# Altium schematic sheet Sheet2.SchDoc
size A4
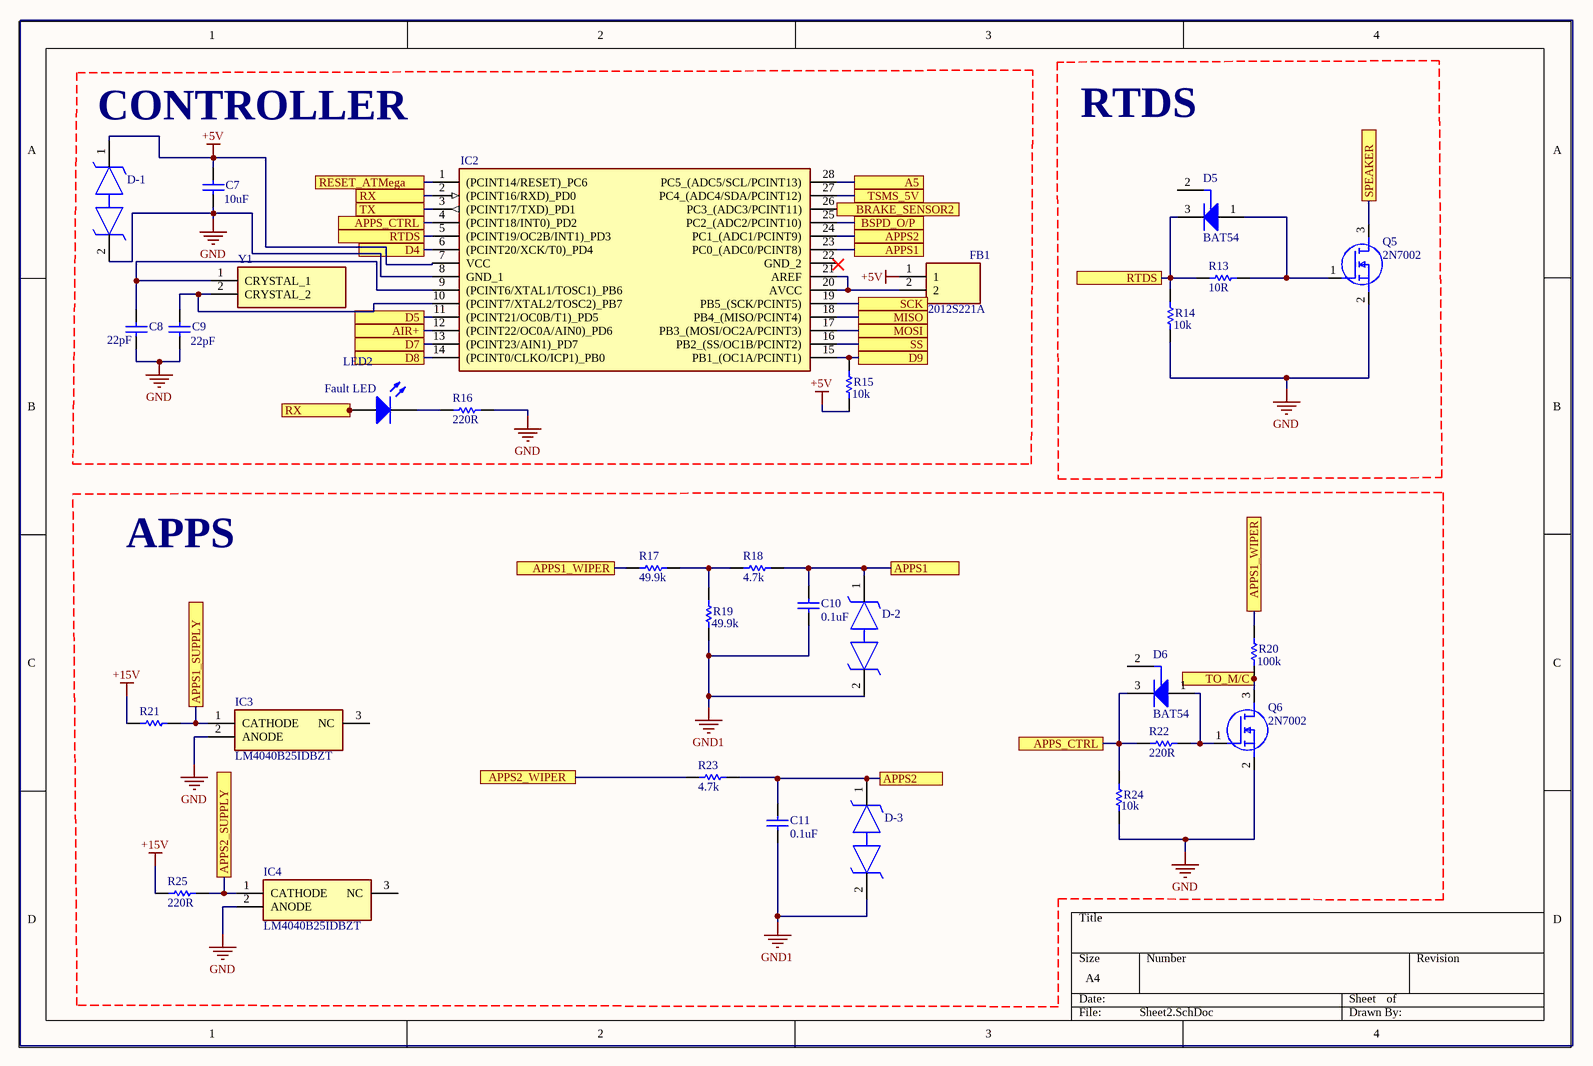
[diagram p0: Sheet2.SchDoc]

## Parts
C7  10uF  [KEMT-1206-2_N]
C8  22pF  [KEMT-1206-2_N]
C9  22pF  [KEMT-1206-2_N]
C10  0.1uF  [KEMT-1206-2_N]
C11  0.1uF  [KEMT-1206-2_N]
D5  BAT54  [INF-SOT23_N]
D6  BAT54  [INF-SOT23_N]
D-1  TPD1E6B06DPLR  [R1206]  (value not drawn)
D-2  TPD1E6B06DPLR  [R1206]  (value not drawn)
D-3  TPD1E6B06DPLR  [R1206]  (value not drawn)
Fault_LED  LED2  [3.2X1.6X1.1]
FB1  MPZ2012S221A  [BEADC2012X105N]
IC2  ATMEGA328-PU  [DIP1016W53P254L3468H457Q28N]  (value not drawn)
IC3  LM4040B25IDBZT  [SOT95P237X112-3N]
IC4  LM4040B25IDBZT  [SOT95P237X112-3N]
Q5  2N7002  [SOT96P240X120-3N]
Q6  2N7002  [SOT96P240X120-3N]
R13  10R  [RESC3216X60X45NL10T20 - duplicate]
R14  10k  [RESC3216X60X45NL10T20 - duplicate]
R15  10k  [RESC3216X60X45NL10T20 - duplicate]
R16  220R  [RESC3216X60X45NL10T20 - duplicate]
R17  49.9k  [RESC3216X60X45NL10T20 - duplicate]
R18  4.7k  [RESC3216X60X45NL10T20 - duplicate]
R19  49.9k  [RESC3216X60X45NL10T20 - duplicate]
R20  100k  [RESC3216X60X45NL10T20 - duplicate]
R21  CRCW120647K0FKEA  [RESC3216X60X45NL10T20 - duplicate]  (value not drawn)
R22  220R  [RESC3216X60X45NL10T20 - duplicate]
R23  4.7k  [RESC3216X60X45NL10T20 - duplicate]
R24  10k  [RESC3216X60X45NL10T20 - duplicate]
R25  220R  [RESC3216X60X45NL10T20 - duplicate]
Y1  ECS-160-18-4X-CKM  [ECS160184XCKM]  (value not drawn)

## Blocks framed on the sheet
CONTROLLER: C7-C9 D-1 Fault_LED FB1 IC2 R15 R16 Y1
APPS: C10 C11 D6 D-2 D-3 IC3 IC4 Q6 R17-R25

## Ports
A5, AIR+, APPS1, APPS1_SUPPLY, APPS1_WIPER, APPS2, APPS2_SUPPLY, APPS2_WIPER, APPS_CTRL, BRAKE_SENSOR2, BSPD_O/P, D4, D5, D7, D8, D9, MISO, MOSI, RESET_ATMega, RTDS, RX, SCK, SPEAKER, SS, TO_M/C, TSMS_5V, TX

## Nets
+5V: C7.2 D-1.1 FB1.1 IC2.7(VCC) R15.1
+15V: R21.2 R25.2
GND: C7.1 C8.1 C9.1 D-1.2 IC2.8(GND_1) IC3.2(ANODE) IC4.2(ANODE) Q5.2(S) Q6.2(S) R14.1 R16.1 R24.1
GND1: C10.1 C11.1 D-2.2 D-3.2 R19.1
A5: IC2.28(PC5_(ADC5/SCL/PCINT13)) ; port A5
AIR+: IC2.12((PCINT22/OC0A/AIN0)_PD6) ; port AIR+
APPS1: C10.2 D-2.1 IC2.23(PC0_(ADC0/PCINT8)) R18.1 ; port APPS1
APPS1_SUPPLY: IC3.1(CATHODE) R21.1 ; port APPS1_SUPPLY
APPS1_WIPER: R17.2 R20.2 ; port APPS1_WIPER
APPS2: C11.2 D-3.1 IC2.24(PC1_(ADC1/PCINT9)) R23.1 ; port APPS2
APPS2_SUPPLY: IC4.1(CATHODE) R25.1 ; port APPS2_SUPPLY
APPS2_WIPER: R23.2 ; port APPS2_WIPER
APPS_CTRL: D6.3(K) IC2.4((PCINT18/INT0)_PD2) R22.2 R24.2 ; port APPS_CTRL
BRAKE_SENSOR2: IC2.26(PC3_(ADC3/PCINT11)) ; port BRAKE_SENSOR2
BSPD_O/P: IC2.25(PC2_(ADC2/PCINT10)) ; port BSPD_O/P
D4: IC2.6((PCINT20/XCK/T0)_PD4) ; port D4
D5: IC2.11((PCINT21/OC0B/T1)_PD5) ; port D5
D7: IC2.13((PCINT23/AIN1)_PD7) ; port D7
D8: IC2.14((PCINT0/CLKO/ICP1)_PB0) ; port D8
D9: IC2.15(PB1_(OC1A/PCINT1)) R15.2 ; port D9
MISO: IC2.18(PB4_(MISO/PCINT4)) ; port MISO
MOSI: IC2.17(PB3_(MOSI/OC2A/PCINT3)) ; port MOSI
RESET_ATMega: IC2.1((PCINT14/RESET)_PC6) ; port RESET_ATMega
RTDS: D5.3(K) IC2.5((PCINT19/OC2B/INT1)_PD3) R13.2 R14.2 ; port RTDS
RX: Fault_LED.1(A) IC2.2((PCINT16/RXD)_PD0) ; port RX
SCK: IC2.19(PB5_(SCK/PCINT5)) ; port SCK
SPEAKER: Q5.3(D) ; port SPEAKER
SS: IC2.16(PB2_(SS/OC1B/PCINT2)) ; port SS
TO_M/C: Q6.3(D) R20.1 ; port TO_M/C
TSMS_5V: IC2.27(PC4_(ADC4/SDA/PCINT12)) ; port TSMS_5V
TX: IC2.3((PCINT17/TXD)_PD1) ; port TX
NetC8_2: C8.2 IC2.9((PCINT6/XTAL1/TOSC1)_PB6) Y1.1(CRYSTAL_1)
NetC9_2: C9.2 IC2.10((PCINT7/XTAL2/TOSC2)_PB7) Y1.2(CRYSTAL_2)
NetD5_1: D5.1(A) Q5.1(G) R13.1
NetD6_1: D6.1(A) Q6.1(G) R22.1
NetFault_LED_2: Fault_LED.2(K) R16.2
NetFB1_2: FB1.2 IC2.20(AVCC) IC2.21(AREF)
NetR17_1: R17.1 R18.2 R19.2

Not connected (* = marked no-connect by the designer): D5 2(NC); D6 2(NC); IC2 22(GND_2); IC3 3(NC); IC4 3(NC)

## Notes on the sheet
- RTDS

## Library data of the parts
C7-C11 = CMP-1037-04202-2: CAP, Ceramic, 0.1 uF, +/- 10%, 50 V, -55 to 125 degC, 1206 (3216 Metric), RoHS, Tape and Reel; Manufacturer: Kemet; Voltage Rating: 50V; Capacitance: 0.1µF; Product Range: KEMET-CSeries; SVHC: ToBeAdvised; Dielectric Characteristic: X7R; Capacitor Case Style: 1206[3216Metric]; Package Reference: 1206-2; Package Description: 2-Leads SMD, Body 3.2 x 1.6 mm; Packaging: Tape&Reel; Operating Temperature Max: 125degC; Capacitance Tolerance: ±10%; Datasheet URL: https://datasheet.ciiva.com/6125/1725438-6125494.pdf; Manufacturer URL: http://www.kemet.com/; Operating Temperature Min: -55degC; Datasheet Version: Jul-13
D5 D6 = CMP-1182-00010-1: Silicon Schottky Diode, SOT23, Reel, Green; Manufacturer: Infineon; VF (max): 800Â mV; Configuration: Single; IF (max): 200Â mA; CT (max): 10Â pF; Green: TRUE; VR (max): 30Â V; PartNumber: BAT54; ComponentLink2URL: http://www.infineon.com/dgdl/bat54series.pdf?folderId=db3a30431400ef68011425f1ca2505e3&fileId=db3a304314dca3890115190b74210ea6; ComponentLink3Description: Package Specification; PackageVersion: Apr-08; PackageDescription: 3-Pin Small Outline Transistor Package, 1.3 x 2.9 mm Body, 0.95 mm Pitch; ComponentLink1Description: Manufacturer URL; ComponentLink1URL: http://www.infineon.com/; Mounting Technology: Surface Mount; Packing: Reel; ComponentLink2Description: Datasheet; PackageReference: SOT23; ComponentLink3URL: http://www.infineon.com/dgdl/SOT23-Package_Overview.pdf?folderId=db3a30431936bc4b0119532290053c66&fileId=db3a30431936bc4b0119533468123c85
Fault_LED = LED2: Typical RED, GREEN, YELLOW, AMBER GaAs LED; Published: 8-Jun-2000; LatestRevisionDate: 17-Jul-2002; LatestRevisionNote: Re-released for DXP Platform.; PackageVersion: Feb-2002; PackageReference: 3.2X1.6X1.1; Publisher: Altium Limited; PackageDescription: SM LED; 2 Flat Leads
FB1 = MPZ2012S221A: Ferrite Bead; Manufacturer_Name: TDK; Datasheet Link: https://product.tdk.com/info/en/catalog/datasheets/beads_commercial_power_mpz2012_en.pdf; Height: 1.05mm; Manufacturer_Part_Number: MPZ2012S221A; Mouser Part Number: 810-MPZ2012S221A; Mouser Price/Stock: https://www.mouser.co.uk/ProductDetail/TDK/MPZ2012S221A?qs=g8DL0B6GkTmmIcDMLnw6hw%3D%3D
IC2 = ATMEGA328-PU: Integrated Circuit; Manufacturer_Name: Microchip; Datasheet Link: https://componentsearchengine.com/Datasheets/1/ATMEGA328-PU.pdf; Height: 4.572mm; Manufacturer_Part_Number: ATMEGA328-PU; Mouser Part Number: 556-ATMEGA328-PU; Mouser Price/Stock: https://www.mouser.co.uk/ProductDetail/Microchip-Technology-Atmel/ATMEGA328-PU?qs=lwdSMh1%2FoYJT8tfItQpQtA%3D%3D; Arrow Part Number: ATMEGA328-PU; Arrow Price/Stock: https://www.arrow.com/en/products/atmega328-pu/microchip-technology
IC3 IC4 = LM4040B25IDBZT: Integrated Circuit; Manufacturer_Name: Texas Instruments; Datasheet Link: https://www.ti.com/lit/gpn/LM4040; Height: 1.12mm; Manufacturer_Part_Number: LM4040B25IDBZT; Mouser Part Number: 595-LM4040B25IDBZT; Mouser Price/Stock: https://www.mouser.com/Search/Refine.aspx?Keyword=595-LM4040B25IDBZT; Arrow Part Number: LM4040B25IDBZT; Arrow Price/Stock: https://www.arrow.com/en/products/lm4040b25idbzt/texas-instruments
Q5 Q6 = 2N7002: MOSFET (N-Channel); Manufacturer_Name: Vishay; Datasheet Link: https://www.diodes.com/assets/Datasheets/ds11303.pdf; Height: 1.2mm; Manufacturer_Part_Number: 2N7002; Mouser Part Number: 781-2N7002; Mouser Price/Stock: https://www.mouser.co.uk/ProductDetail/Vishay-Siliconix/2N7002?qs=xBpwZ0JX2zKeuvZKtdYLZQ%3D%3D
R13-R20 R22-R25 = CMP-2003-02213-1: Part Number: CRCW120647K0FKEA; Manufacturer: Vishay Dale
R21 = CMP-2003-02213-1: Manufacturer: Vishay Dale; Part Number: CRCW120647K0FKEA
Y1 = ECS-160-18-4X-CKM: Crystal or Oscillator; Manufacturer_Name: ECS; Datasheet Link: https://www.mouser.be/datasheet/2/122/hc-49usx-791.pdf; Height: 3.5mm; Manufacturer_Part_Number: ECS-160-18-4X-CKM; Mouser Part Number: 520-ECS160-18-4X-CKM; Mouser Price/Stock: https://www.mouser.co.uk/ProductDetail/ECS/ECS-160-18-4X-CKM?qs=7MVldsJ5UawYqyimirccKw%3D%3D